# Altium schematic sheet Motor Control - Phase B.SchDoc: [10] Motor Control - Phase B
size A4; ApprovedBy: Nagy Richard; CheckedBy: Nagy Richard; Author: Nagy Richard; CompanyName: EmbedCore; DrawnBy: Nagy Richard; Engineer: Nagy Richard; Organization: EmbedCore; Revision: 1.0; SheetNumber: 10; SheetTotal: 25
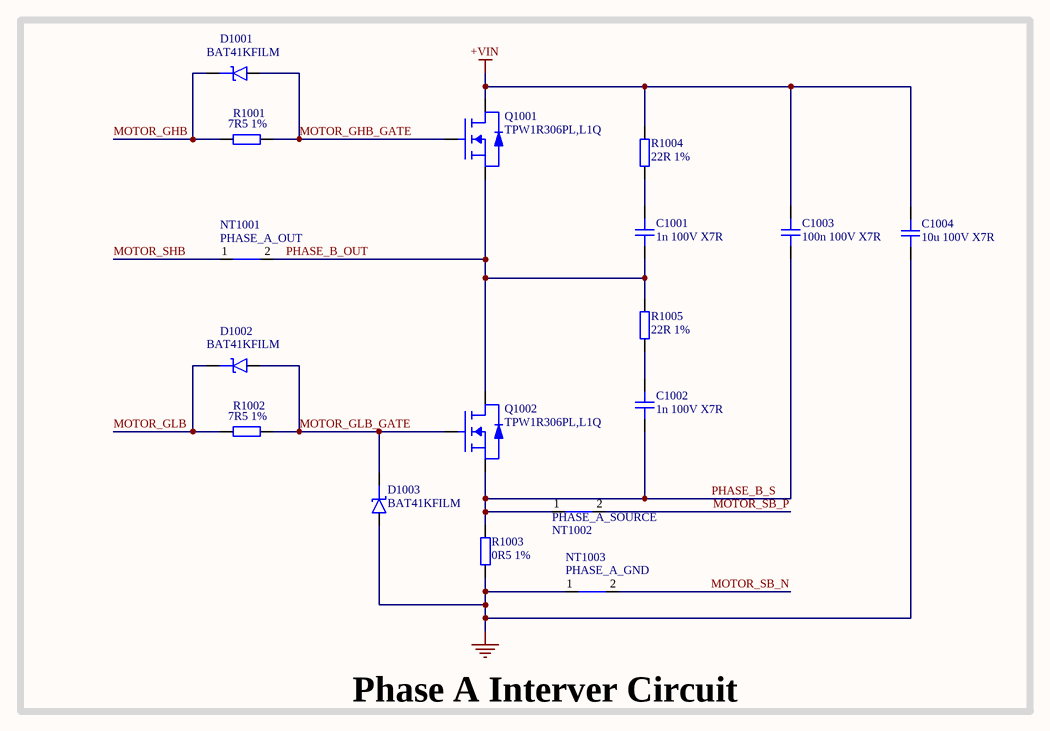
[diagram p0: Motor Control - Phase B.SchDoc]

## Parts
C1001  1n 100V X7R  [CAP_0805]
C1002  1n 100V X7R  [CAP_0805]
C1003  100n 100V X7R  [CAP_1206]
C1004  10u 100V X7R  [CAP_1210]
D1001  BAT41KFILM  [SOD-523]
D1002  BAT41KFILM  [SOD-523]
D1003  BAT41KFILM  [SOD-523]
NT1001  PHASE_A_OUT  [NETTIE_SMD]  (net tie, no BOM)
NT1002  PHASE_A_SOURCE  [NETTIE_SMD]  (net tie, no BOM)
NT1003  PHASE_A_GND  [NETTIE_SMD]  (net tie, no BOM)
Q1001  TPW1R306PL,L1Q  [PowerPAK-SO-8]
Q1002  TPW1R306PL,L1Q  [PowerPAK-SO-8]
R1001  7R5 1%  [RES_0603]
R1002  7R5 1%  [RES_0603]
R1003  0R5 1%  [RES_1206]
R1004  22R 1%  [RES_0805]
R1005  22R 1%  [RES_0805]

## Blocks framed on the sheet
Phase A Interver Circuit: C1001-C1004 D1001-D1003 NT1001-NT1003 Q1001 Q1002 R1001-R1005

## Nets
+VIN: C1003.2 C1004.2 Q1001.D R1004.2
GND: C1004.1 D1003.A NT1003.1 R1003.1
MOTOR_GHB: D1001.K R1001.1
MOTOR_GHB_GATE: D1001.A Q1001.G R1001.2
MOTOR_GLB: D1002.K R1002.1
MOTOR_GLB_GATE: D1002.A D1003.K Q1002.G R1002.2
MOTOR_SB_N: NT1003.2
MOTOR_SB_P: NT1002.2
MOTOR_SHB: NT1001.1
PHASE_B_OUT: C1001.1 NT1001.2 Q1001.S Q1002.D R1005.2
PHASE_B_S: C1002.1 C1003.1 NT1002.1 Q1002.S R1003.2
NetC1001_2: C1001.2 R1004.1
NetC1002_2: C1002.2 R1005.1

## Notes on the sheet
- Title:
- Drawn By:
- Page Contents:
- Checked By:
- Size:
- Date:
- File:
- License:
- Email:
- A4
- Number:
- Time:
- Revision:
- Sheet
- Website:
- of

## Library data of the parts
C1001 C1002 = CAP_0805: Capacitor SMD 0805; Manufacturer: Kyocera AVX; Manufacturer Part Number: 08051C102JAT2A; Distributor Link: www.lcsc.com; LCSC: C2169492; Rating: *; Dielectric: *
C1003 = CAP_1206: Capacitor SMD 1206; Manufacturer: YAGEO; Manufacturer Part Number: CC1206JKX7R0BB104; Distributor Link: www.lcsc.com; LCSC: C726629; Rating: *; Dielectric: *
C1004 = CAP_1210: Capacitor SMD 1210; Manufacturer: PSA(Prosperity Dielectrics); Manufacturer Part Number: FS32X106K101EGG; Distributor Link: www.lcsc.com; LCSC: C5156756; Rating: *; Dielectric: *
D1001-D1003 = D_SCHOTTKY_SOD_523: Diode Schottky SMD SOD-323; Manufacturer: STMicroelectronics; Manufacturer Part Number: BAT41KFILM; LCSC: C73150
NT1001-NT1003 = NetTie_SMD: Net Tie SMD
Q1001 Q1002 = SIR500DP-T1-RE3: MOSFET N-Channel Vds=30V Id=351A Rds=470uR; Manufacturer: Vishay; Manufacturer Part Number: SIR500DP-T1-RE3
R1001 R1002 = RES_0603: Resistor SMD 0603; Manufacturer: PANASONIC; Manufacturer Part Number: ERJPA3J7R5V; Distributor Link: www.lcsc.com; LCSC: C445790
R1003 = RES_1206: Resistor SMD 1206; Manufacturer: Milliohm; Manufacturer Part Number: HoSRX1206-3W-0.5mR-1%; Distributor Link: www.lcsc.com; LCSC: C18724161
R1004 R1005 = RES_0805: Resistor SMD 0805; Manufacturer: Viking Tech; Manufacturer Part Number: ARG05FTC0220; Distributor Link: www.lcsc.com; LCSC: C218436